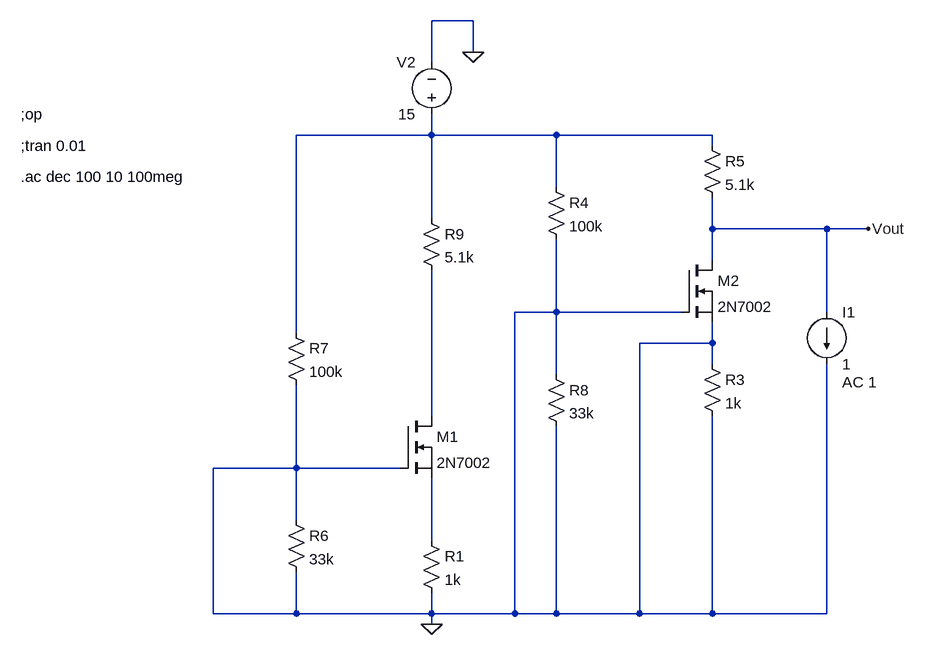
[diagram p0: schematic Nhóm05-L02-BTL MDTNC (Series-Shunt_nofeedback - Copy).asc]
Nhóm05-L02-BTL MDTNC (Series-Shunt_nofeedback - Copy).asc, the LTspice schematic file:
Version 4
SHEET 1 1016 680
WIRE 336 -480 272 -480
WIRE 336 -432 336 -480
WIRE 272 -416 272 -480
WIRE 272 -304 272 -336
WIRE 272 -304 64 -304
WIRE 464 -304 272 -304
WIRE 704 -304 464 -304
WIRE 704 -288 704 -304
WIRE 464 -224 464 -304
WIRE 272 -176 272 -304
WIRE 704 -160 704 -208
WIRE 880 -160 704 -160
WIRE 944 -160 880 -160
WIRE 704 -112 704 -160
WIRE 464 -32 464 -144
WIRE 464 -32 400 -32
WIRE 656 -32 464 -32
WIRE 880 -32 880 -160
WIRE 64 0 64 -304
WIRE 704 16 704 -16
WIRE 704 16 592 16
WIRE 704 48 704 16
WIRE 464 64 464 -32
WIRE 272 128 272 -96
WIRE 64 208 64 80
WIRE 64 208 -64 208
WIRE 224 208 64 208
WIRE 64 288 64 208
WIRE 272 320 272 224
WIRE -64 432 -64 208
WIRE 64 432 64 368
WIRE 64 432 -64 432
WIRE 272 432 272 400
WIRE 272 432 64 432
WIRE 400 432 400 -32
WIRE 400 432 272 432
WIRE 464 432 464 144
WIRE 464 432 400 432
WIRE 592 432 592 16
WIRE 592 432 464 432
WIRE 704 432 704 128
WIRE 704 432 592 432
WIRE 880 432 880 48
WIRE 880 432 704 432
WIRE 272 448 272 432
FLAG 272 448 0
FLAG 336 -432 0
FLAG 944 -160 Vout
SYMBOL nmos 224 128 R0
SYMATTR InstName M1
SYMATTR Value 2N7002
SYMBOL nmos 656 -112 R0
SYMATTR InstName M2
SYMATTR Value 2N7002
SYMBOL res 256 304 R0
SYMATTR InstName R1
SYMATTR Value 1k
SYMBOL voltage 272 -320 R180
WINDOW 0 24 96 Left 2
WINDOW 3 24 16 Left 2
WINDOW 123 0 0 Left 0
WINDOW 39 0 0 Left 0
SYMATTR InstName V2
SYMATTR Value 15
SYMBOL res 688 -304 R0
SYMATTR InstName R5
SYMATTR Value 5.1k
SYMBOL res 688 32 R0
SYMATTR InstName R3
SYMATTR Value 1k
SYMBOL res 48 272 R0
SYMATTR InstName R6
SYMATTR Value 33k
SYMBOL res 48 -16 R0
SYMATTR InstName R7
SYMATTR Value 100k
SYMBOL res 448 -240 R0
SYMATTR InstName R4
SYMATTR Value 100k
SYMBOL res 448 48 R0
SYMATTR InstName R8
SYMATTR Value 33k
SYMBOL res 256 -192 R0
SYMATTR InstName R9
SYMATTR Value 5.1k
SYMBOL current 880 -32 R0
WINDOW 123 24 108 Left 2
WINDOW 39 0 0 Left 0
SYMATTR Value2 AC 1
SYMATTR InstName I1
SYMATTR Value 1
TEXT -360 -336 Left 2 !;op
TEXT -360 -288 Left 2 !;tran 0.01
TEXT -360 -240 Left 2 !.ac dec 100 10 100meg

The netlist it stands for:
* Nhóm05-L02-BTL MDTNC (Series-Shunt_nofeedback - Copy).asc
M1 N002 0 N003 N003 2N7002
M2 Vout 0 0 0 2N7002
R1 N003 0 1k
V2 N001 0 15
R5 N001 Vout 5.1k
R3 0 0 1k
R6 0 0 33k
R7 N001 0 100k
R4 N001 0 100k
R8 0 0 33k
R9 N001 N002 5.1k
I1 Vout 0 1 AC 1
.model NMOS NMOS
.model PMOS PMOS
.lib standard.mos
;op
;tran 0.01
.ac dec 100 10 100meg
.backanno
.end